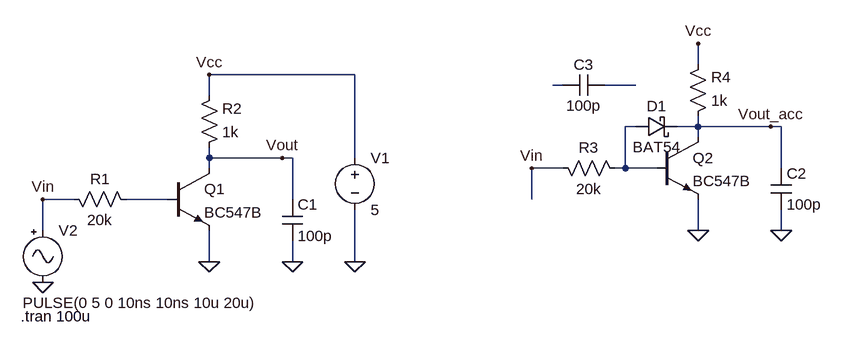
[diagram p0: schematic Lab2_2.asc]
Lab2_2.asc, the LTspice schematic file:
Version 4
SHEET 1 1160 680
WIRE 960 -464 960 -496
WIRE 432 -448 208 -448
WIRE 752 -432 736 -432
WIRE 864 -432 816 -432
WIRE 208 -416 208 -448
WIRE 864 -368 848 -368
WIRE 960 -368 960 -384
WIRE 960 -368 928 -368
WIRE 1072 -368 960 -368
WIRE 1088 -368 1072 -368
WIRE 960 -352 960 -368
WIRE 208 -320 208 -336
WIRE 320 -320 208 -320
WIRE 336 -320 320 -320
WIRE 432 -320 432 -448
WIRE 208 -304 208 -320
WIRE 752 -304 704 -304
WIRE 848 -304 848 -368
WIRE 848 -304 832 -304
WIRE 896 -304 848 -304
WIRE 1088 -304 1088 -368
WIRE 0 -256 -48 -256
WIRE 144 -256 80 -256
WIRE 336 -256 336 -320
WIRE 704 -256 704 -304
WIRE -48 -208 -48 -256
WIRE 960 -208 960 -256
WIRE 1088 -208 1088 -240
WIRE 208 -160 208 -208
WIRE 336 -160 336 -192
WIRE 432 -160 432 -240
FLAG 208 -160 0
FLAG 336 -160 0
FLAG 432 -160 0
FLAG -48 -128 0
FLAG -48 -256 Vin
FLAG 320 -320 Vout
FLAG 208 -448 Vcc
FLAG 960 -208 0
FLAG 1088 -208 0
FLAG 704 -304 Vin
FLAG 1072 -368 Vout_acc
FLAG 960 -496 Vcc
SYMBOL res -16 -272 M90
WINDOW 0 0 56 VBottom 2
WINDOW 3 32 56 VTop 2
SYMATTR InstName R1
SYMATTR Value 20k
SYMBOL res 192 -320 M180
WINDOW 0 36 76 Left 2
WINDOW 3 36 40 Left 2
SYMATTR InstName R2
SYMATTR Value 1k
SYMBOL cap 320 -256 R0
SYMATTR InstName C1
SYMATTR Value 100p
SYMBOL voltage 432 -336 R0
WINDOW 123 0 0 Left 0
WINDOW 39 0 0 Left 0
SYMATTR InstName V1
SYMATTR Value 5
SYMBOL npn 144 -304 R0
SYMATTR InstName Q1
SYMATTR Value BC547B
SYMBOL Misc\\signal -48 -224 R0
WINDOW 3 -31 127 Left 2
WINDOW 123 0 0 Left 0
WINDOW 39 0 0 Left 0
SYMATTR InstName V2
SYMATTR Value PULSE(0 5 0 10ns 10ns 10u 20u)
SYMBOL res 736 -320 M90
WINDOW 0 0 56 VBottom 2
WINDOW 3 32 56 VTop 2
SYMATTR InstName R3
SYMATTR Value 20k
SYMBOL res 944 -368 M180
WINDOW 0 36 76 Left 2
WINDOW 3 36 40 Left 2
SYMATTR InstName R4
SYMATTR Value 1k
SYMBOL cap 1072 -304 R0
SYMATTR InstName C2
SYMATTR Value 100p
SYMBOL npn 896 -352 R0
SYMATTR InstName Q2
SYMATTR Value BC547B
SYMBOL cap 816 -448 R90
WINDOW 0 0 32 VBottom 2
WINDOW 3 32 32 VTop 2
SYMATTR InstName C3
SYMATTR Value 100p
SYMBOL schottky 864 -384 M90
WINDOW 0 0 32 VBottom 2
WINDOW 3 32 32 VTop 2
SYMATTR InstName D1
SYMATTR Value BAT54
TEXT -82 -76 Left 2 !.tran 100u

The netlist it stands for:
* Lab2_2.asc
R1 Vin N004 20k
R2 Vout Vcc 1k
C1 Vout 0 100p
V1 Vcc 0 5
Q1 Vout N004 0 0 BC547B
V2 Vin 0 PULSE(0 5 0 10ns 10ns 10u 20u)
R3 Vin N003 20k
R4 Vout_acc Vcc 1k
C2 Vout_acc 0 100p
Q2 Vout_acc N003 0 0 BC547B
C3 N002 N001 100p
D1 N003 Vout_acc BAT54
.model D D
.lib standard.dio
.model NPN NPN
.model PNP PNP
.lib standard.bjt
.tran 100u
.backanno
.end